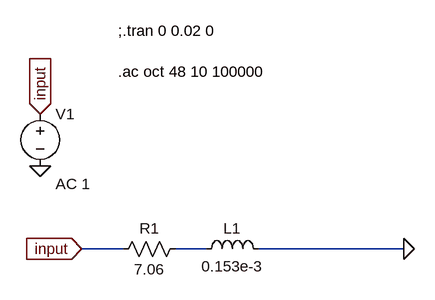
[diagram p0: schematic demo_00.asc]
demo_00.asc, the LTspice schematic file:
Version 4
SHEET 1 880 680
WIRE 160 336 96 336
WIRE 288 336 240 336
WIRE 592 336 368 336
FLAG 32 208 0
FLAG 32 128 input
IOPIN 32 128 In
FLAG 592 336 0
FLAG 96 336 input
IOPIN 96 336 In
SYMBOL voltage 32 112 R0
WINDOW 123 24 124 Left 2
WINDOW 39 0 0 Left 0
SYMATTR InstName V1
SYMATTR Value ""
SYMATTR Value2 AC 1
SYMBOL res 144 352 R270
WINDOW 0 32 56 VTop 2
WINDOW 3 0 56 VBottom 2
SYMATTR InstName R1
SYMATTR Value 7.06
SYMBOL ind 272 352 R270
WINDOW 0 32 56 VTop 2
WINDOW 3 5 56 VBottom 2
SYMATTR InstName L1
SYMATTR Value 0.153e-3
TEXT 152 0 Left 2 !;.tran 0 0.02 0\n\n.ac oct 48 10 100000

The netlist it stands for:
* demo_00.asc
V1 input 0 AC 1
R1 input N001 7.06
L1 N001 0 0.153e-3
;.tran 0 0.02 0
.ac oct 48 10 100000
.backanno
.end

* Results of the author's LTspice run, read from the files saved beside the schematic
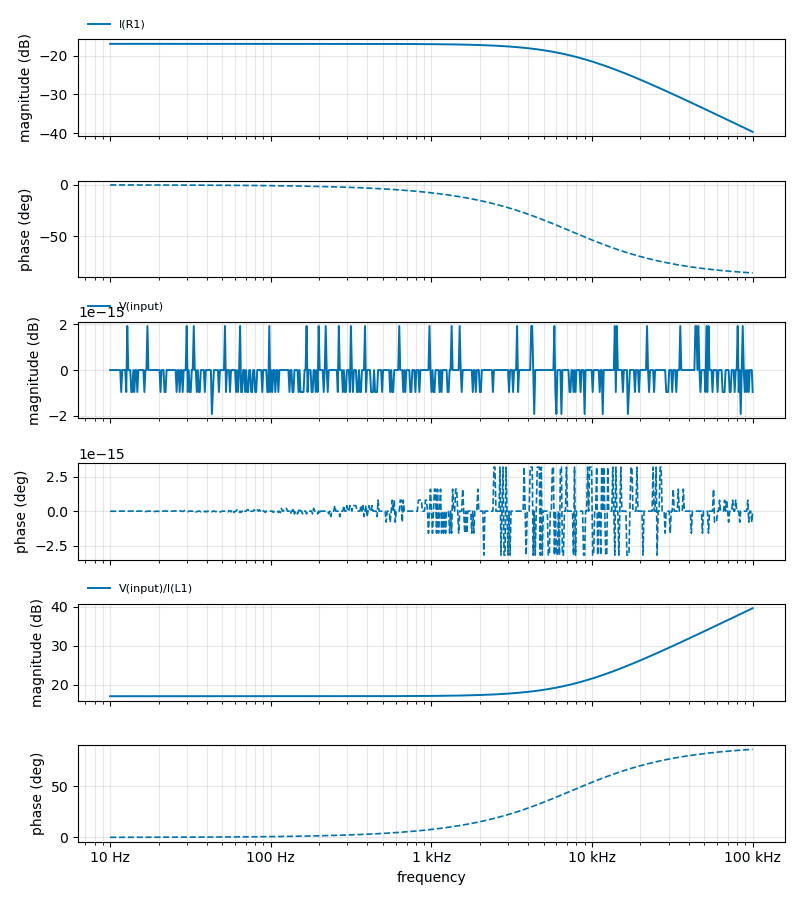
[diagram p1: AC Analysis of demo_00.asc, plotted from the saved traces]
* AC Analysis, 1 run:
*   I(R1): -16.98 dB at 10 Hz, -39.68 dB at 100 kHz, peak -16.98 dB at 10 Hz, 3 dB below the peak at 7.345 kHz
*   V(input): 0.00 dB at 10 Hz, -0.00 dB at 100 kHz, peak 0.00 dB at 12.78 Hz
*   V(input)/I(L1): 16.98 dB at 10 Hz, 39.68 dB at 100 kHz, peak 39.68 dB at 100 kHz, 3 dB below the peak at 70.52 kHz